# EAGLE design slave_board (EAGLE 9.5.1)
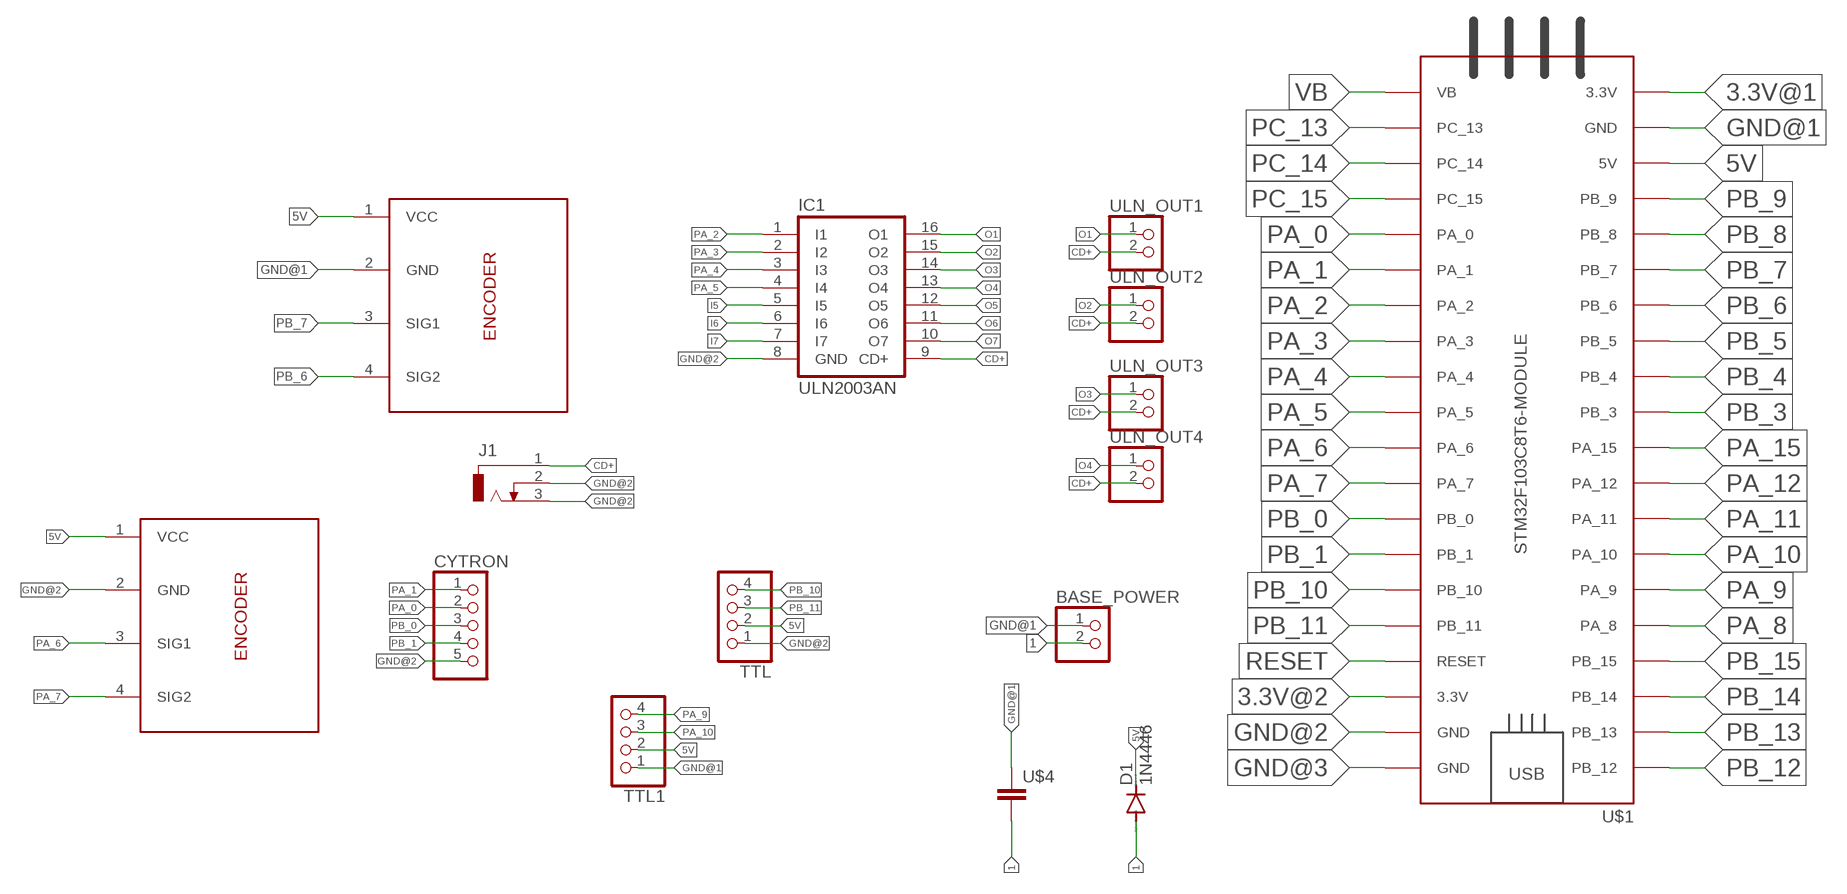
[diagram p0: schematic, sheet 1]

## Parts
BASE_POWER  PINHD-2_DATA  [1X02_DATA]
CYTRON  PINHD-5_DATA  [1X05_DATA]
D1  1N4446  [DO35-10]
IC1  ULN2003AN  [DIL16]
J1  CON_JACK  [DCJ0303]
TTL  PINHD-4_DATA  [1X04_DATA]
TTL1  PINHD-4_DATA  [1X04_DATA]
U$1  STM32F103C8T6-MODULE  [STM32F103C8T6-MODULE]
U$2  ENCODER  [1X04_DATA]
U$3  ENCODER  [1X04_DATA]
U$4  CAPACITOR  [C025-025X050]
ULN_OUT1  PINHD-2_DATA  [1X02_DATA]
ULN_OUT2  PINHD-2_DATA  [1X02_DATA]
ULN_OUT3  PINHD-2_DATA  [1X02_DATA]
ULN_OUT4  PINHD-2_DATA  [1X02_DATA]

## Nets
1: BASE_POWER.2 D1.A U$4.2
3.3V@1: U$1.3.3V_1(3.3V)
3.3V@2: U$1.3.3V_2(3.3V)
5V: D1.C TTL1.2 TTL.2 U$1.5V U$2.1(VCC) U$3.1(VCC)
CD+: IC1.9(CD+) J1.1 ULN_OUT1.2 ULN_OUT2.2 ULN_OUT3.2 ULN_OUT4.2
GND@1: BASE_POWER.1 TTL1.1 U$1.GND_1(GND) U$3.2(GND) U$4.1
GND@2: CYTRON.5 IC1.8(GND) J1.2 J1.3 TTL.1 U$1.GND_2(GND) U$2.2(GND)
GND@3: U$1.GND_3(GND)
I5: IC1.5(I5)
I6: IC1.6(I6)
I7: IC1.7(I7)
O1: IC1.16(O1) ULN_OUT1.1
O2: IC1.15(O2) ULN_OUT2.1
O3: IC1.14(O3) ULN_OUT3.1
O4: IC1.13(O4) ULN_OUT4.1
O5: IC1.12(O5)
O6: IC1.11(O6)
O7: IC1.10(O7)
PA_0: CYTRON.2 U$1.PA_0
PA_1: CYTRON.1 U$1.PA_1
PA_2: IC1.1(I1) U$1.PA_2
PA_3: IC1.2(I2) U$1.PA_3
PA_4: IC1.3(I3) U$1.PA_4
PA_5: IC1.4(I4) U$1.PA_5
PA_6: U$1.PA_6 U$2.3(SIG1)
PA_7: U$1.PA_7 U$2.4(SIG2)
PA_8: U$1.PA_8
PA_9: TTL1.4 U$1.PA_9
PA_10: TTL1.3 U$1.PA_10
PA_11: U$1.PA_11
PA_12: U$1.PA_12
PA_15: U$1.PA_15
PB_0: CYTRON.3 U$1.PB_0
PB_1: CYTRON.4 U$1.PB_1
PB_3: U$1.PB_3
PB_4: U$1.PB_4
PB_5: U$1.PB_5
PB_6: U$1.PB_6 U$3.4(SIG2)
PB_7: U$1.PB_7 U$3.3(SIG1)
PB_8: U$1.PB_8
PB_9: U$1.PB_9
PB_10: TTL.4 U$1.PB_10
PB_11: TTL.3 U$1.PB_11
PB_12: U$1.PB_12
PB_13: U$1.PB_13
PB_14: U$1.PB_14
PB_15: U$1.PB_15
PC_13: U$1.PC_13
PC_14: U$1.PC_14
PC_15: U$1.PC_15
RESET: U$1.RESET
VB: U$1.VB

## Library data of the parts
BASE_POWER ULN_OUT1-ULN_OUT4 = MIA_LIBRARY-2-2-2:PINHD-2_DATA: PIN HEADER
CYTRON = MIA_LIBRARY-2-2-2:PINHD-5_DATA: PIN HEADER
D1 = diode:1N4446: DIODE high speed (Philips)
IC1 = MIA_LIBRARY-2-2-2:ULN2003A: DRIVER ARRAY
J1 = MIA_LIBRARY-2-2-2:CON_JACK: DC POWER JACK Source: DCJ0303.pdf; OC_FARNELL: unknown; OC_NEWARK: unknown
TTL TTL1 = MIA_LIBRARY-2-2-2:PINHD-4_DATA: PIN HEADER
U$1 = MIA_LIBRARY-2-2-2:STM32F103C8T6-MODULE: STM32F103C8T6 module with ARM Cortex-3, 20kB SRAM, 64kB Flash, 72MHz
U$2 U$3 = MIA_LIBRARY-2-2-2:ENCODER
U$4 = MIA_LIBRARY-2-2-2:CAPACITOR

## Board
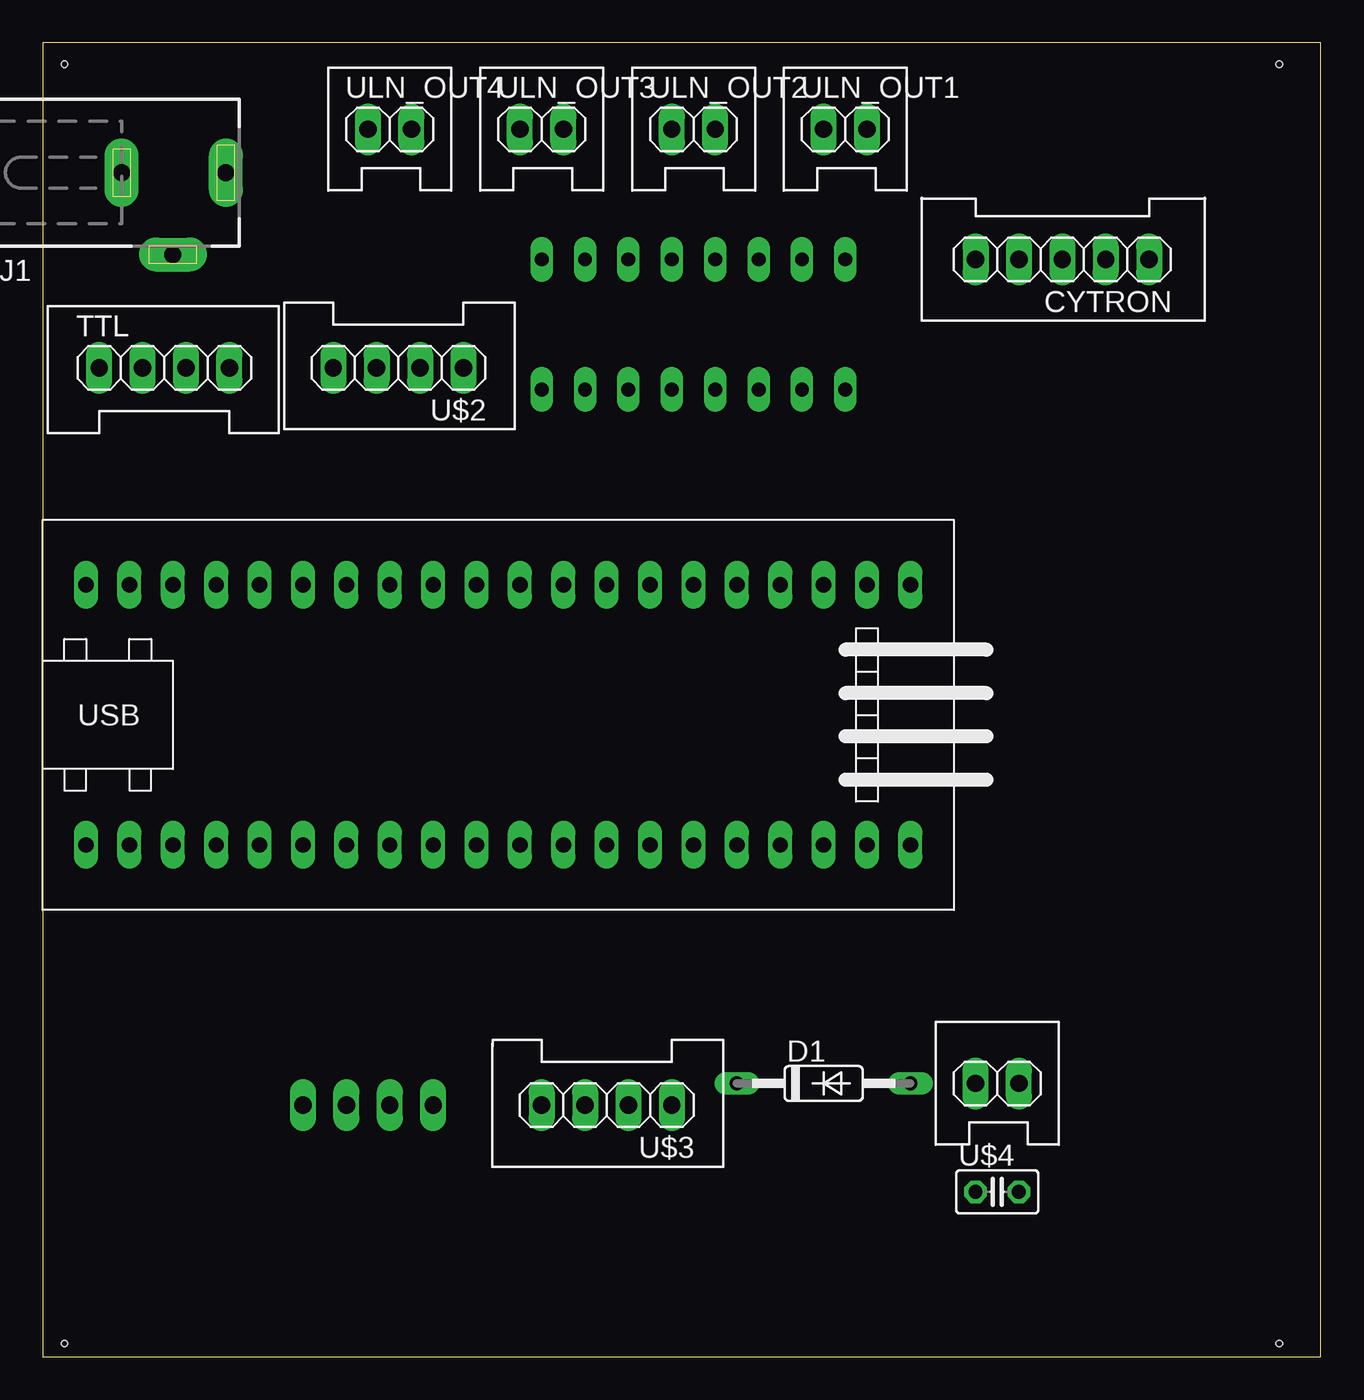
[diagram p1: board, top side]
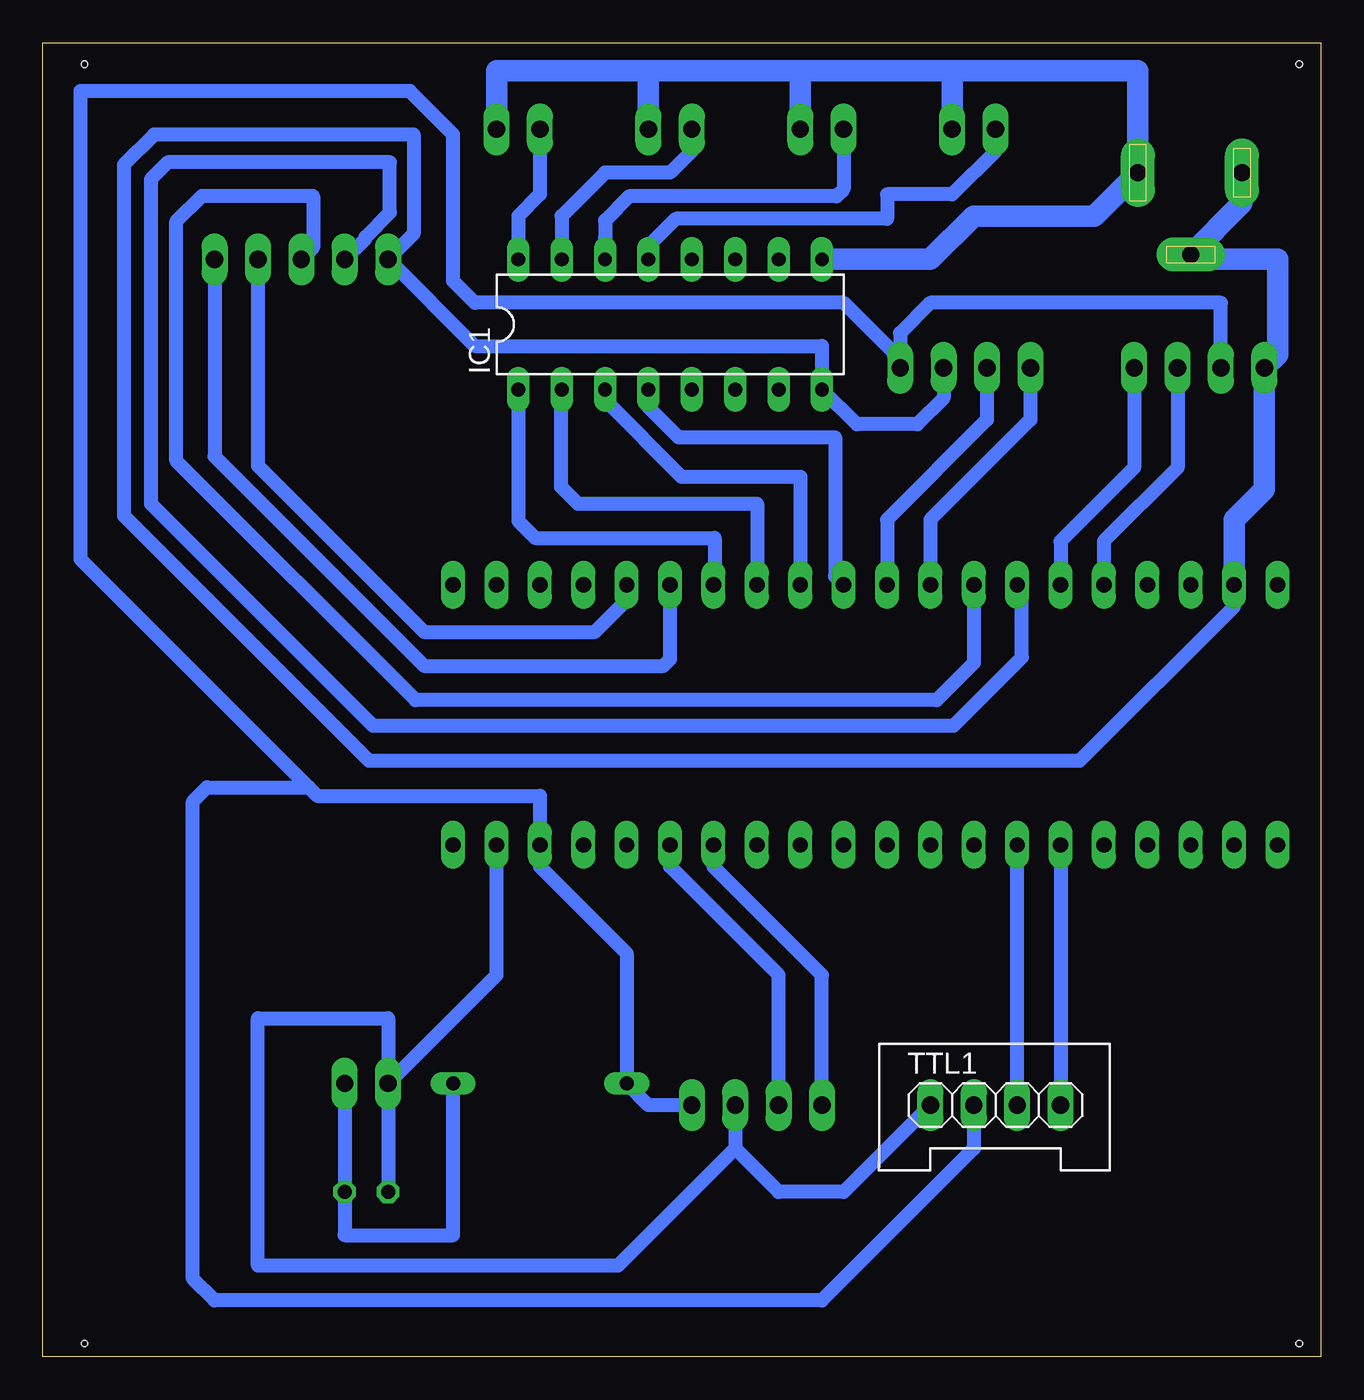
[diagram p2: board, bottom side, seen from below]

Size 74.83 x 76.96 mm. Coordinates in mm from the lower left corner, seen from the top.
Outline: 0,0 74.83,0 74.83,76.96 0,76.96 0,0
Copper layers (1*16): Top 0.035mm / dielectric 1.5mm / Bottom 0.035mm
Design rules "default": minimum track width 6mil, minimum drill 0.35mm, track to track 6mil, track to pad 6mil, pad to pad 6mil, via to via 6mil, smd to smd 6mil, copper to edge 40mil, drill to drill 6mil, minimum pad ring 10mil, minimum via ring 8mil, stop-mask expansion 4mil, vias tented up to drill 0mil, thermal gap 10mil
Holes 0.35 mm at 1.27,75.7 72.39,75.7 72.39,0.77 1.27,0.77

### Footprints (pad centres in the part's own frame; a part is rotated, then mirrored left to right if it is on the bottom)
1X02_DATA = drill 1.016 long: 1 -1.27,0; 2 1.27,0
1X05_DATA = drill 1.016 long: 1 -5.08,0; 2 -2.54,0; 3 0,0; 4 2.54,0; 5 5.08,0
DO35-10 = drill 0.813 long: A 5.08,0; C -5.08,0
DIL16 = drill 0.813 long: 1 -8.89,-3.81; 2 -6.35,-3.81; 3 -3.81,-3.81; 4 -1.27,-3.81; 5 1.27,-3.81; 6 3.81,-3.81; 7 6.35,-3.81; 8 8.89,-3.81; 9 8.89,3.81; 10 6.35,3.81; 11 3.81,3.81; 12 1.27,3.81; 13 -1.27,3.81; 14 -3.81,3.81; 15 -6.35,3.81; 16 -8.89,3.81
DCJ0303 = drill 1 pad 2 long: 1 0,3.1; 2 4.8,0; 3 0,-3
1X04_DATA = drill 1.016 long: 1 -3.81,0; 2 -1.27,0; 3 1.27,0; 4 3.81,0
STM32F103C8T6-MODULE = drill 0.9 long: 3.3V_1 25.4,-7.62; 3.3V_2 -17.78,7.62; 5V 20.32,-7.62; GND_1 22.86,-7.62; GND_2 -20.32,7.62; GND_3 -22.86,7.62; PA_0 15.24,7.62; PA_1 12.7,7.62; PA_2 10.16,7.62; PA_3 7.62,7.62; PA_4 5.08,7.62; PA_5 2.54,7.62; PA_6 0,7.62; PA_7 -2.54,7.62; PA_8 -12.7,-7.62; PA_9 -10.16,-7.62; PA_10 -7.62,-7.62; PA_11 -5.08,-7.62; PA_12 -2.54,-7.62; PA_15 0,-7.62; PB_0 -5.08,7.62; PB_1 -7.62,7.62; PB_3 2.54,-7.62; PB_4 5.08,-7.62; PB_5 7.62,-7.62; PB_6 10.16,-7.62; PB_7 12.7,-7.62; PB_8 15.24,-7.62; PB_9 17.78,-7.62; PB_10 -10.16,7.62; PB_11 -12.7,7.62; PB_12 -22.86,-7.62; PB_13 -20.32,-7.62; PB_14 -17.78,-7.62; PB_15 -15.24,-7.62; PC_13 22.86,7.62; PC_14 20.32,7.62; PC_15 17.78,7.62; RESET -15.24,7.62; VB 25.4,7.62
C025-025X050 = drill 0.813 octagon: 1 -1.27,0; 2 1.27,0

### Placement (x,y rotation side)
BASE_POWER  55.88,16.01 0 top
CYTRON  59.69,64.27 180 top
D1  45.72,16.01 0 top
IC1  38.1,60.46 0 bottom
J1  7.62,69.35 270 top
TTL  7.12,57.92 0 top
TTL1  19.05,14.74 0 bottom
U$1  25.4,37.6 0 top
U$2  20.82,57.92 180 top
U$3  33.02,14.74 180 top
U$4  55.88,9.66 0 top
ULN_OUT1  46.99,71.89 0 top
ULN_OUT2  38.1,71.89 0 top
ULN_OUT3  29.21,71.89 0 top
ULN_OUT4  20.32,71.89 0 top

### Tracks (layer width: path | path; a pad name or v marks a point on that pad's centre or on a via)
1
  Bottom 0.813: BASE_POWER.2 U$4.2 57.15,7.12 50.8,7.12 D1.A
5V
  Bottom 0.813: TTL.2 5.85,61.73 22.86,61.73 24.63,59.96 U$2.1 24.63,58.42 27.94,61.73 49.53,61.73 50.8,63 50.8,71.58 53.34,74.12 72.62,74.12 72.62,46.72 59.25,33.35 | 59.25,33.35 58.75,32.85 45.72,32.85 U$1.5V 45.72,28.71 40.64,23.63 D1.C 39.37,14.74 U$3.1 | TTL1.2 20.32,12.2 29.21,3.31 64.77,3.31 66.04,4.58 66.04,32.52 65.21,33.35 59.25,33.35
CD+
  Bottom 1.27: IC1.9 22.86,64.27 20.32,66.81 13.26,66.81 J1.1 10.72,75.31 21.59,75.31 | 21.59,75.31 30.48,75.31 | 30.48,75.31 39.37,75.31 | 39.37,75.31 48.26,75.31 ULN_OUT1.2 | ULN_OUT4.2 21.59,75.31 | ULN_OUT3.2 30.48,75.31 | ULN_OUT2.2 39.37,75.31
GND@1
  Bottom 0.813: BASE_POWER.1 U$4.1 | BASE_POWER.1 48.26,22.36 U$1.GND_1 | 34.24,14.7 U$3.2 34.29,12.2 | BASE_POWER.1 54.61,19.82 62.23,19.82 62.23,5.35 41.14,5.35 34.29,12.2 | TTL1.1 27.94,9.66 31.75,9.66 34.29,12.2
GND@2
  Bottom 0.813: U$2.2 22.09,56.15 23.63,54.61 27.17,54.61 IC1.8 29.21,59.19 49.53,59.19 CYTRON.5 53.11,65.77 53.11,71.58 68.31,71.58 70.08,69.81 70.08,49.26 55.73,34.91 14.12,34.91 5.08,43.95 U$1.GND_2
  Bottom 1.27: J1.3 4.62,67.55 J1.2 | J1.2 6.63,65.54 | U$1.GND_2 5.08,49.03 3.31,50.8 TTL.1 2.54,58.69 2.54,64.27 7.34,64.27 J1.2
O1
  Bottom 0.813: IC1.16 46.99,66.81 45.72,68.08 ULN_OUT1.1
O2
  Bottom 0.813: ULN_OUT2.1 36.83,70.62 38.1,69.35 41.91,69.35 44.45,66.81 IC1.15
O3
  Bottom 0.813: ULN_OUT3.1 27.94,68.38 28.36,67.96 40.5,67.96 41.91,66.55 41.91,65.54 41.91,64.96 IC1.14
O4
  Bottom 0.813: ULN_OUT4.1 19.05,70.62 21.59,68.08 25.4,68.08 25.4,66.65 37.76,66.65 39.37,65.04 IC1.13
PA_0
  Bottom 0.813: U$1.PA_0 40.5,45.08 40.5,44.46 42.5,42.46 52.5,42.46 62.23,52.19 CYTRON.2
PA_1
  Bottom 0.813: CYTRON.1 64.77,52.73 52.5,40.46 38.5,40.46 38.1,40.86 U$1.PA_1
PA_2
  Bottom 0.813: IC1.1 46.99,48.95 46,47.96 35.5,47.96 35.5,45.28 U$1.PA_2
PA_3
  Bottom 0.813: IC1.2 44.5,56.6 44.5,50.96 43.5,49.96 33,49.96 33,45.24 U$1.PA_3
PA_4
  Bottom 0.813: U$1.PA_4 30.48,51.55 37.44,51.55 41.91,56.02 IC1.3
PA_5
  Bottom 0.813: U$1.PA_5 28.44,45.72 28.44,53.86 37.62,53.86 39.37,55.61 IC1.4
PA_6
  Bottom 0.813: U$1.PA_6 25.4,49.03 19.55,54.88 U$2.3
PA_7
  Bottom 0.813: U$2.4 17.01,54.88 22.86,49.03 U$1.PA_7
PA_9
  Bottom 0.813: U$1.PA_9 TTL1.4
PA_10
  Bottom 0.813: TTL1.3 U$1.PA_10
PB_0
  Bottom 0.813: U$1.PB_0 20.32,40.64 22.5,38.46 53,38.46 67,52.46 67,66.49 65.5,67.99 59.03,67.99 59,67.96 59,64.96 CYTRON.3
PB_1
  Bottom 0.813: CYTRON.4 55.93,65.49 55.93,65.58 54.5,67.01 54.5,69.96 67.5,69.96 68.5,68.96 68.5,49.96 55.5,36.96 21.5,36.96 17.5,40.96 17.5,44.94 U$1.PB_1
PB_6
  Bottom 0.813: U$3.4 29.21,22.36 35.56,28.71 U$1.PB_6
PB_7
  Bottom 0.813: U$3.3 31.75,22.36 38.1,28.71 U$1.PB_7
PB_10
  Bottom 0.813: TTL.4 10.93,52.07 15.24,47.76 U$1.PB_10
PB_11
  Bottom 0.813: TTL.3 8.39,52.07 12.7,47.76 U$1.PB_11